# EAGLE design nrf to serial (EAGLE 9.7.0)
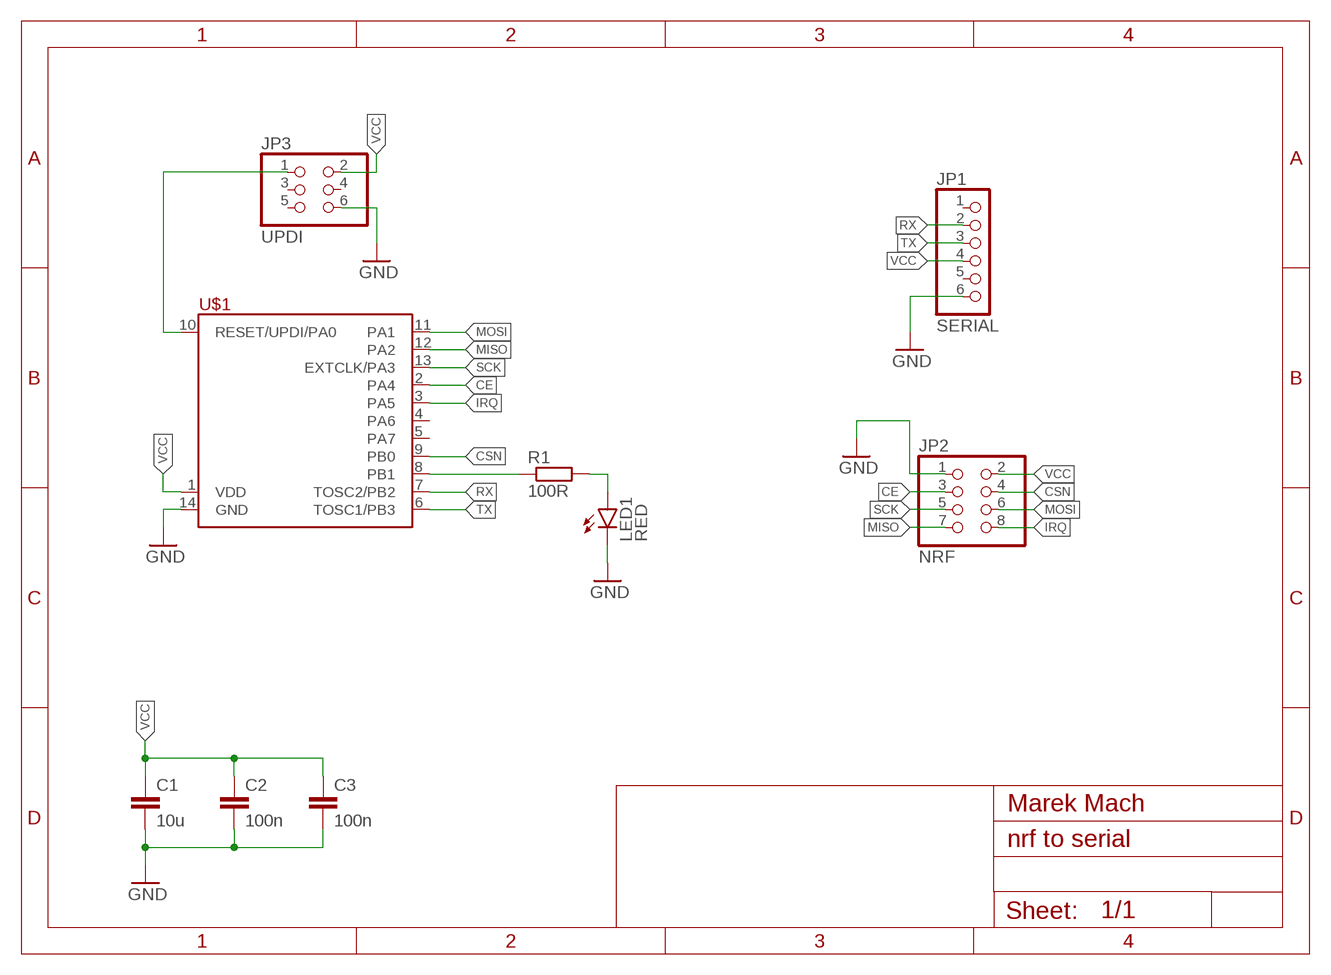
[diagram p0: schematic, sheet 1]

## Parts
C1  10u  C-EUC0603  [C0603]
C2  100n  C-EUC0603  [C0603]
C3  100n  C-EUC0603  [C0603]
JP1  SERIAL  PINHD-1X6  [1X06]
JP2  NRF  PINHD-2X4  [2X04]
JP3  UPDI  PINHD-2X3  [2X03]
LED1  RED  LED3MM  [LED3MM]
R1  100R  R-EU_R0603  [R0603]
U$1  TINY214/414/814SOIC  [SOIC14]

## Nets
CE: JP2.3 U$1.2(PA4)
CSN: JP2.4 U$1.9(PB0)
GND: C1.2 C2.2 C3.2 JP1.6 JP2.1 JP3.6 LED1.K(C) U$1.14(GND)
IRQ: JP2.8 U$1.3(PA5)
MISO: JP2.7 U$1.12(PA2)
MOSI: JP2.6 U$1.11(PA1)
N$1: R1.1 U$1.8(PB1)
N$2: JP3.1 U$1.10(RESET/UPDI/PA0)
N$3: LED1.A R1.2
RX: JP1.2 U$1.7(TOSC2/PB2)
SCK: JP2.5 U$1.13(EXTCLK/PA3)
TX: JP1.3 U$1.6(TOSC1/PB3)
VCC: C1.1 C2.1 C3.1 JP1.4 JP2.2 JP3.2 U$1.1(VDD)
Unconnected: JP1.1 JP1.5 JP3.3 JP3.4 JP3.5 U$1.4(PA6) U$1.5(PA7)

## Notes on the sheet
- Marek Mach

## Library data of the parts
C1-C3 = rcl:C-EU: CAPACITOR, European symbol; SPICEPREFIX: C
JP1 = pinhead:PINHD-1X6: PIN HEADER
JP2 = pinhead:PINHD-2X4: PIN HEADER
JP3 = pinhead:PINHD-2X3: PIN HEADER
LED1 = led:LED: LED OSRAM: - CHIPLED LG R971, LG N971, LY N971, LG Q971, LY Q971, LO R971, LY R971 LH N974, LH R974 LS Q976, LO Q976, LY Q976 LO Q996 - Hyper CHIPLED LW Q18S LB Q993, LB Q99A, LB R99A - SideLED LS A670, LO A670, LY A670, LG A670, LP A670 LB A673, LV A673, LT A673, LW A673 LH A674 LY A675 LS A676, LA A676, LO A676, LY A676, LW A676 LS A679, LY A679, LG A679 - Hyper Micro SIDELED® LS Y876, LA Y876, LO Y876, LY Y876 LT Y87S - SmartLED LW L88C, LW L88S LB L89C, LB L89S, LG L890 LS L89K, LO L89K, LY L89K LS L896, LA L896, LO L896, LY L896 - TOPLED LS T670, LO T670, LY T670, LG T670, LP T670 LSG T670, LSP T670, LSY T670, LOP T670, LYG T670 LG T671, LOG T671, LSG T671 LB T673, LV T673, LT T673, LW T673 LH T674 LS T676, LA T676, LO T676, LY T676, LB T676, LH T676, LSB T676, LW T676 LB T67C, LV T67C, LT T67C, LS T67K, LO T67K, LY T67K, LW E67C LS E67B, LA E67B, LO E67B, LY E67B, LB E67C, LV E67C, LT E67C LW T67C LS T679, LY T679, LG T679 LS T770, LO T770, LY T770, LG T770, LP T770 LB T773, LV T773, LT T773, LW T773 LH T774 LS E675, LA E675, LY E675, LS T675 LS T776, LA T776, LO T776, LY T776, LB T776 LHGB T686 LT T68C, LB T68C - Hyper Mini TOPLED® LB M676 - Mini TOPLED Santana® LG M470 LS M47K, LO M47K, LY M47K Source: http://www.osram.convergy.de LUXEON: - LUMILED® LXK2-PW12-R00, LXK2-PW12-S00, LXK2-PW14-U00, LXK2-PW14-V00 LXK2-PM12-R00, LXK2-PM12-S00, LXK2-PM14-U00 LXK2-PE12-Q00, LXK2-PE12-R00, LXK2-PE12-S00, LXK2-PE14-T00, LXK2-PE14-U00 LXK2-PB12-K00, LXK2-PB12-L00, LXK2-PB12-M00, LXK2-PB14-N00, LXK2-PB14-P00, LXK2-PB14-Q00 LXK2-PR12-L00, LXK2-PR12-M00, LXK2-PR14-Q00, LXK2-PR14-R00 LXK2-PD12-Q00, LXK2-PD12-R00, LXK2-PD12-S00 LXK2-PH12-R00, LXK2-PH12-S00 LXK2-PL12-P00, LXK2-PL12-Q00, LXK2-PL12-R00 Source: www.luxeon.com KINGBRIGHT: KA-3528ASYC Source: www.kingbright.com
R1 = rcl:R-EU_: RESISTOR, European symbol; SPICEPREFIX: R
U$1 = avr-7:TINY214/414/814

## Board
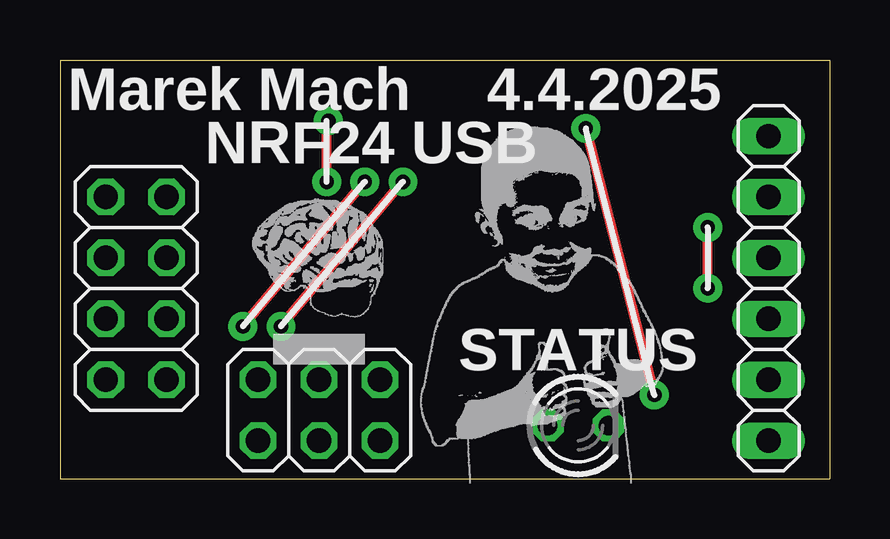
[diagram p1: board, top side]
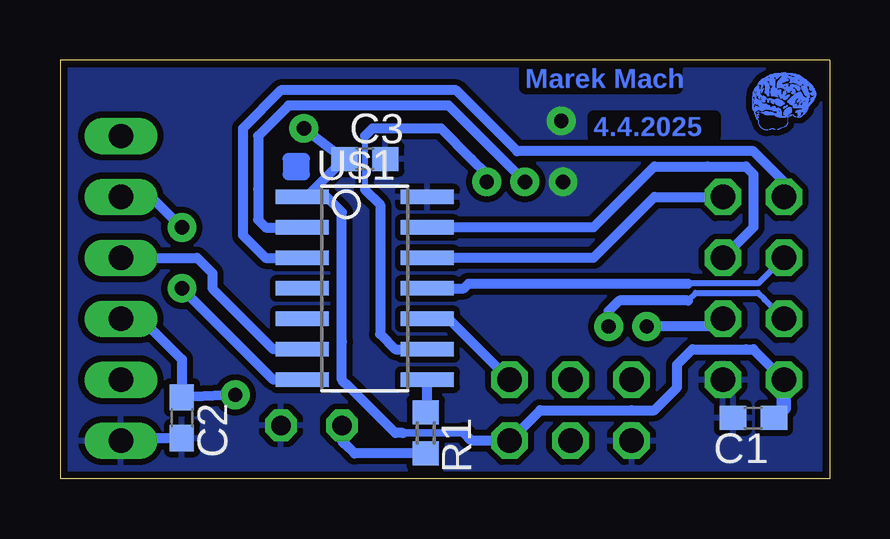
[diagram p2: board, bottom side, seen from below]

Size 32.07 x 17.46 mm. Coordinates in mm from the lower left corner, seen from the top.
Outline: 0,0 32.07,0 32.07,17.46 0,17.46 0,0
Copper layers (1*16): Top 0.035mm / dielectric 1.5mm / Bottom 0.035mm
Design rules "Fusion Electronics Design Rules *": minimum track width 6mil, minimum drill 0.35mm, track to track 6mil, track to pad 6mil, pad to pad 6mil, via to via 6mil, smd to smd 6mil, copper to edge 12mil, drill to drill 6mil, minimum pad ring 10mil, minimum via ring 8mil, stop-mask expansion 4mil, vias tented up to drill 9999mil, thermal gap 10mil

### Footprints (pad centres in the part's own frame; a part is rotated, then mirrored left to right if it is on the bottom)
C0603 = smd 1.1 x 1: 1 -0.85,0; 2 0.85,0
1X06 = drill 1.016 long: 1 -6.35,0; 2 -3.81,0; 3 -1.27,0; 4 1.27,0; 5 3.81,0; 6 6.35,0
2X04 = drill 1.016 octagon: 1 -3.81,-1.27; 2 -3.81,1.27; 3 -1.27,-1.27; 4 -1.27,1.27; 5 1.27,-1.27; 6 1.27,1.27; 7 3.81,-1.27; 8 3.81,1.27
2X03 = drill 1.016 octagon: 1 -2.54,-1.27; 2 -2.54,1.27; 3 0,-1.27; 4 0,1.27; 5 2.54,-1.27; 6 2.54,1.27
LED3MM = drill 0.813 octagon: A -1.27,0; K 1.27,0
R0603 = smd 1 x 1.1: 1 -0.85,0; 2 0.85,0
SOIC14 = smd 0.61 x 2.21: 1 -3.81,-2.603; 2 -2.54,-2.603; 3 -1.27,-2.603; 4 0,-2.603; 5 1.27,-2.603; 6 2.54,-2.603; 7 3.81,-2.603; 8 3.81,2.603; 9 2.54,2.603; 10 1.27,2.603; 11 0,2.603; 12 -1.27,2.603; 13 -2.54,2.603; 14 -3.81,2.603

### Placement (x,y rotation side)
C1  3.17,2.54 180 bottom
C2  26.99,2.54 270 bottom
C3  19.37,13.34 0 bottom
JP1  29.53,7.94 270 top
JP2  3.17,7.94 90 top
JP3  10.79,2.86 180 top
LED1  21.59,2.22 0 top
R1  16.83,1.91 270 bottom
U$1  19.37,7.94 270 bottom

### Tracks (layer width: path | path; a pad name or v marks a point on that pad's centre or on a via)
CE  (via drill 0.6 pad 1.2)
  Top 0.406: v7.62,6.35 v12.7,12.38
  Bottom 0.406: JP2.3 4.76,6.35 v7.62,6.35 | U$1.2 23.49,10.48 23.81,10.79 23.81,12.06 23.81,14.29 22.54,15.56 15.88,15.56 v12.7,12.38
CSN  (via drill 0.6 pad 1.2)
  Top 0.406: v9.21,6.35 v14.29,12.38
  Bottom 0.254: 19.37,14.29 19.37,12.06 | 5.91,7.43 5.59,7.75 2.98,7.75 2.71,7.47 JP2.4
  Bottom 0.406: U$1.9 18.1,5.4 18.73,6.03 18.73,11.43 19.37,12.06 | 19.37,14.29 19.05,14.61 16.83,14.61 16.19,14.61 14.92,13.34 14.29,12.7 v14.29,12.38 | 5.91,7.43 8.76,7.43 9.21,6.99 v9.21,6.35
GND  (via drill 0.6 pad 1.2)
  Top 0.406: v11.11,12.38 11.11,14.85 v11.18,14.92
  Bottom 0.406: C2.2 29.43,1.69 JP1.6
  pour Bottom (isolate 0.254): 0.08,0.08 32.94,0.08 32.94,17.7 0.08,17.7
IRQ
  Bottom 0.406: JP2.8 1.9,12.38 3.17,13.65 13.02,13.65 15.56,16.19 22.86,16.19 24.45,14.61 24.45,10.16 23.49,9.21 U$1.3
MISO
  Bottom 0.406: U$1.12 9.84,9.21 7.62,11.43 7.3,11.75 JP2.7
MOSI
  Bottom 0.254: 5.91,8.13 5.88,8.15 2.96,8.15 JP2.6
  Bottom 0.406: U$1.11 15.24,7.94 15.05,8.13 5.91,8.13
N$1
  Bottom 0.406: R1.1 16.76,2.82 U$1.8
N$2
  Bottom 0.406: JP3.1 15.87,6.67 U$1.10
N$3
  Bottom 0.406: R1.2 19.79,1.05 20,1.27 20.32,1.59 LED1.A
N$4
  Bottom 0.508: 21.91,13.34 22.54,13.34 22.54,12.7 | 22.54,12.7 21.91,12.7 21.91,13.34 | 21.91,13.34 22.54,12.7
RX  (via drill 0.6 pad 1.2)
  Top 0.406: v26.99,7.94 v26.99,10.48
  Bottom 0.406: U$1.7 23.18,4.13 v26.99,7.94 | v26.99,10.48 28.26,11.75 JP1.2
SCK
  Bottom 0.406: U$1.13 9.84,10.48 7.94,12.38 7.3,13.02 5.08,13.02 3.49,13.02 3.17,12.7 3.17,10.79 3.17,10.48 JP2.5
TX
  Bottom 0.406: U$1.6 23.18,5.4 25.72,7.94 25.72,8.57 26.35,9.21 JP1.3
VCC  (via drill 0.6 pad 1.2)
  Top 0.406: v21.91,14.61 v24.77,3.49
  Bottom 0.305: 15.24,1.91 17.78,1.91
  Bottom 0.406: JP2.2 3.17,5.4 3.49,5.4 5.71,5.4 6.35,4.76 6.35,4.45 6.35,3.81 7.3,2.86 8.26,2.86 12.07,2.86 JP3.2 14.92,1.59 15.24,1.91 | 21.81,11.75 C3.1 v21.91,14.61 | 21.81,11.75 U$1.1 | 21.81,11.75 20.95,11.75 20.32,11.11 20.32,5.71 20.32,4.13 20,3.81 18.1,1.91 17.78,1.91 | JP1.4 28.68,6.67 26.99,4.98 C2.1 v24.77,3.49
  Bottom 0.61: C1.1 1.9,2.96 JP2.2
(copper drawn outside any net)
  shapes: Bottom area x1330

### Text on the board
Bottom: Marek Mach | 4.4.2025
tPlace: NRF24 USB
tNames: Marek Mach | 4.4.2025 | STATUS